# Altium schematic sheet Connectors.SchDoc
size Letter
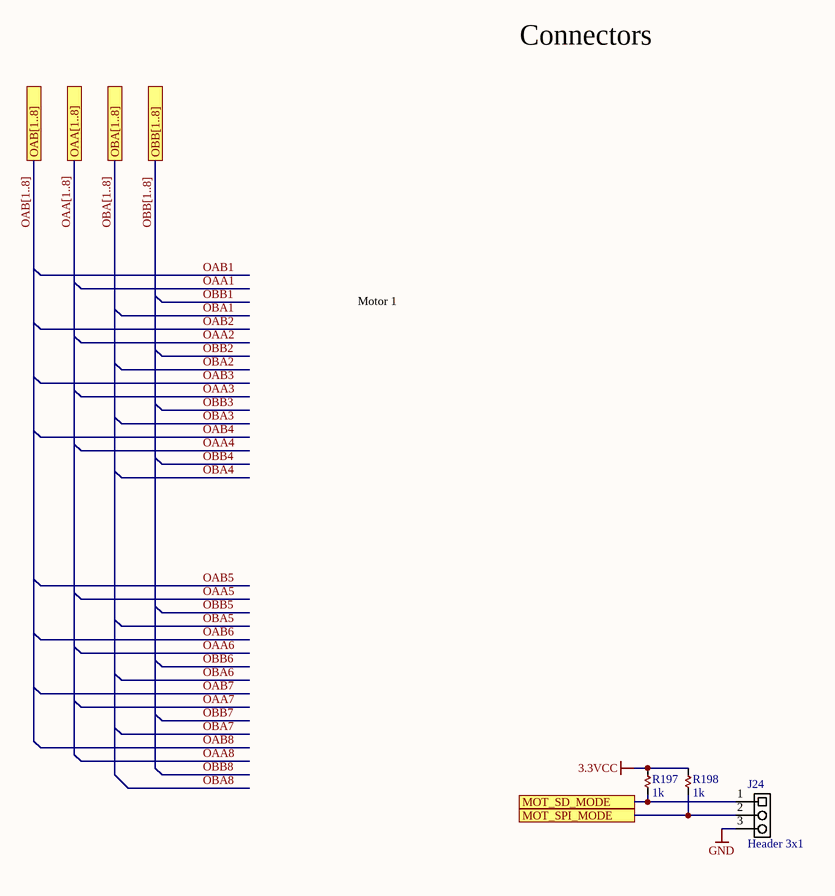
[diagram p0: Connectors.SchDoc]

## Parts
J24  Header 3x1  [HDR3X1]
R197  1k  [R0402]
R198  1k  [R0402]

## Ports
MOT_SD_MODE, MOT_SPI_MODE, OAA[1..8], OAB[1..8], OBA[1..8], OBB[1..8]

## Nets
3.3VCC: R197.2 R198.2
GND: J24.3
MOT_SD_MODE: J24.1 R197.1 ; port MOT_SD_MODE
MOT_SPI_MODE: J24.2 R198.1 ; port MOT_SPI_MODE

## Buses and harness runs
bus OAA[1..8] = port OAA[1..8]
bus OAB[1..8] = port OAB[1..8]
bus OBA[1..8] = port OBA[1..8]
bus OBB[1..8] = port OBB[1..8]

## Notes on the sheet
- Connectors
- Motor 1
- Title:
- Project:
- File:
- Ver:
- Drawn by:
- Sheet:
- of

## Library data of the parts
J24 = Header 3x1 Male Pin: Header 3Pin 1Row T-Hole; MANUFACTURER #: 2211S-03G; MANUFACTURER: Multicomp; PART: CONN 3Pin 1Row 0.1"; PART DESCRIPTION: MULTICOMP  2211S-03G  Board-To-Board Connector, 2.54 mm, 3 Contacts, Header, 2211S Series, Through Hole, 1 Rows; TOLERANCE: -NA-; VALUE: JMP; DISTRIBUTOR #: 08N6745; DISTRIBUTOR: Newark; EE_SPEC: -NA-
R197 R198 = 1k 1% 0402: RES 0402 1k 63mW 1%; MANUFACTURER: Yageo; MANUFACTURER #: RC0402FR-071KL; PART DESCRIPTION: 1k Ohm ±1% 0.063W, 1/16W Chip Resistor 0402 (1005 Metric) Moisture Resistant Thick Film; EE_SPEC: 1/16W; VALUE: 1k; DISTRIBUTOR #: 311-1.00KLRTR-ND; DISTRIBUTOR: Digikey; PART: 1k 1% 0402; TOLERANCE: 1%